# Altium schematic sheet 如意硬件GPRS模块0831.SchDoc
size A4
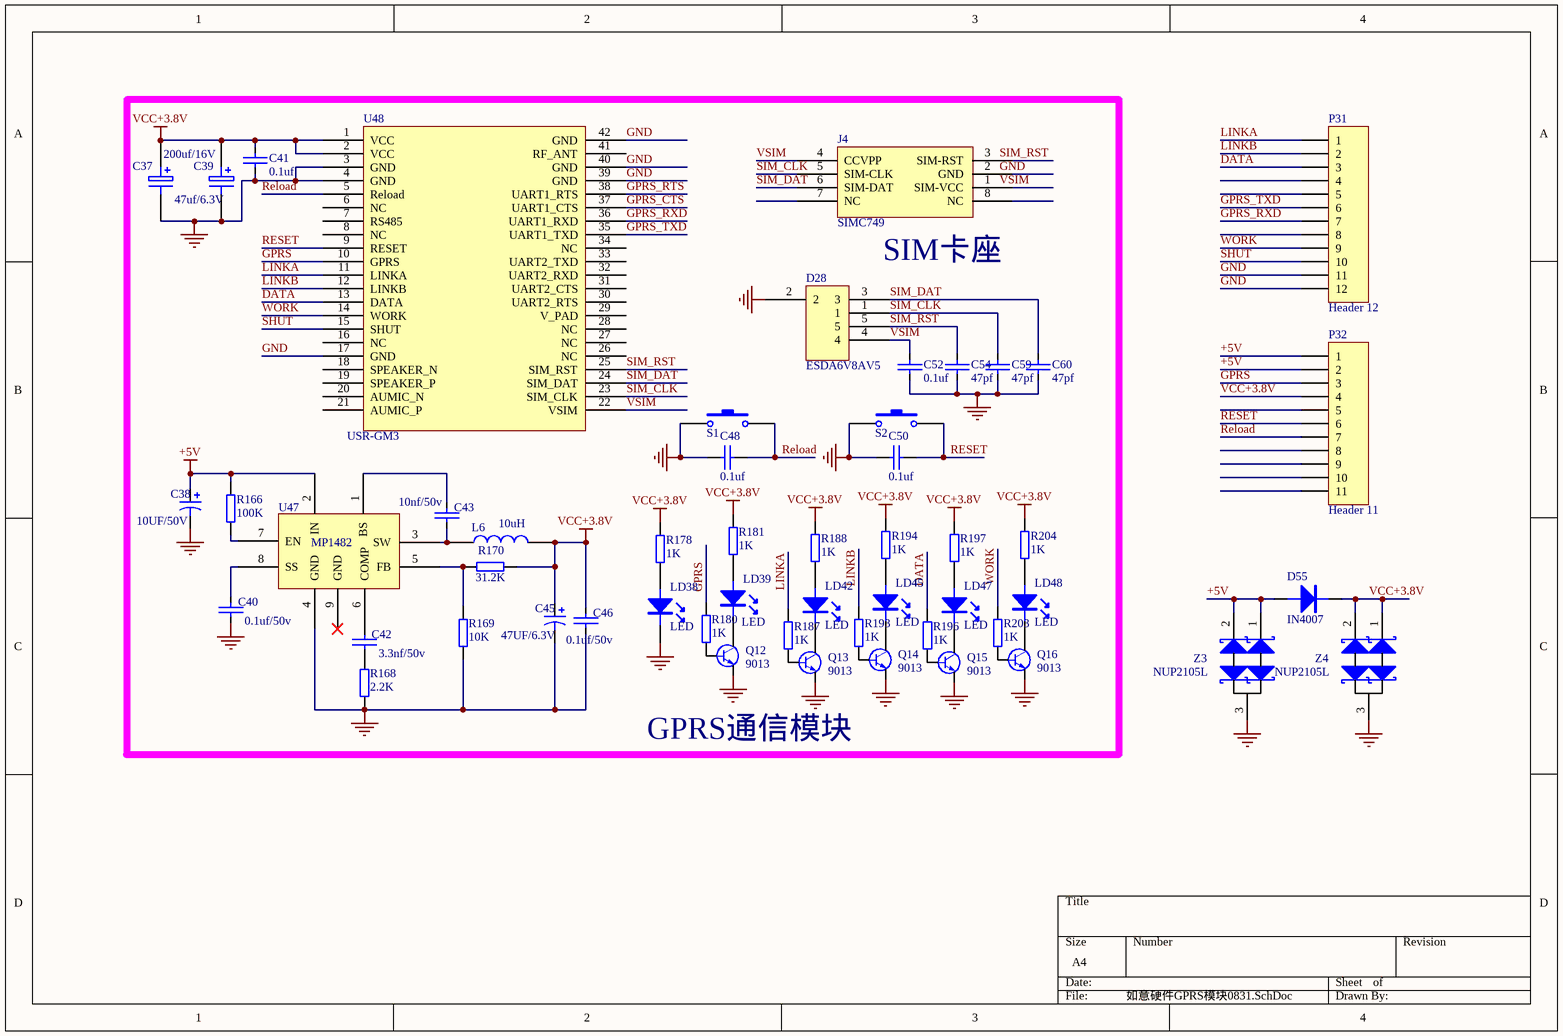
[diagram p0: 如意硬件GPRS模块0831.SchDoc]

## Parts
C37  200uf/16V  [1206D-S]
C38  value 10UF/50V  [1206D-S]  (hidden comment: Cap Pol1)
C39  47uf/6.3V  [1206D-S]
C40  0.1uf/50v  [0603C-1]
C41  0.1uf  [0603C-1]
C42  3.3nf/50v  [0603C-1]
C43  10nf/50v  [1206D-S]
C45  value 47UF/6.3V  [1206D-S]  (hidden comment: Cap Pol1)
C46  0.1uf/50v  [0603C-1]
C48  0.1uf  [0603C-1]
C50  0.1uf  [0603C-1]
C52  0.1uf  [0603C-1]
C54  47pf  [0603C-1]
C59  47pf  [0603C-1]
C60  47pf  [0603C-1]
D28  ESDA6V8AV5  [SOT-553]
D55  IN4007  [DIODETP-5]
J4  SIMC749  [SIMPUSH]
L6  10uH  [NR8030]
LD38  LED  [LED_Z1]
LD39  LED  [LED_Z1]
LD42  LED  [LED_Z1]
LD45  LED  [LED_Z1]
LD47  LED  [LED_Z1]
LD48  LED  [LED_Z1]
P31  Header 12  [HDR1X12]
P32  Header 11  [HDR1X11]
Q12  9013  [SOT23-BCE]
Q13  9013  [SOT23-BCE]
Q14  9013  [SOT23-BCE]
Q15  9013  [SOT23-BCE]
Q16  9013  [SOT23-BCE]
R166  100K  [0603R-1]
R168  2.2K  [0603R-1]
R169  10K  [0603R-1]
R170  31.2K  [0603R-1]
R178  1K  [0603R-1]
R180  1K  [0603R-1]
R181  1K  [0603R-1]
R187  1K  [0603R-1]
R188  1K  [0603R-1]
R193  1K  [0603R-1]
R194  1K  [0603R-1]
R196  1K  [0603R-1]
R197  1K  [0603R-1]
R203  1K  [0603R-1]
R204  1K  [0603R-1]
S1  SW-PB  [SW_PB4_A1]  (value not drawn)
S2  SW-PB  [SW_PB4_A1]  (value not drawn)
U47  MP1482  [SO-8]  (value not drawn)
U48  USR-GM3  [USR-GM3]
Z3  NUP2105L  [SOT-23]
Z4  NUP2105L  [SOT-23]

## Nets
+5V: C38.1 D55.1(A) P32.1 P32.2 R166.1 U47.2(IN) Z3.1 Z3.2
GND: C37.2 C38.2 C39.2 C40.2 C41.2 C45.2 C46.2 C48.2 C50.2 C52.2 C54.2 C59.2 C60.2 D28.2 LD38.2 P31.11 P31.12 Q12.E Q13.E Q14.E Q15.E Q16.E R168.2 R169.2 S1.1 S2.1 U47.4(GND) U48.3(GND) U48.4(GND) U48.17(GND) U48.39(GND) U48.40(GND) U48.42(GND) Z3.3 Z4.3
VCC+3.8V: C37.1 C39.1 C41.1 C45.1 C46.1 D55.2(K) L6.2 P32.4 R170.2 R178.1 R181.1 R188.1 R194.1 R197.1 R204.1 U48.1(VCC) U48.2(VCC) Z4.1 Z4.2
DATA: P31.3 R196.1 U48.13(DATA)
GPRS: P32.3 R180.1 U48.10(GPRS)
GPRS_CTS: U48.37(UART1_CTS)
GPRS_RTS: U48.38(UART1_RTS)
GPRS_RXD: P31.7 U48.36(UART1_RXD)
GPRS_TXD: P31.6 U48.35(UART1_TXD)
LINKA: P31.1 R187.1 U48.11(LINKA)
LINKB: P31.2 R193.1 U48.12(LINKB)
Reload: C48.1 P32.7 S1.2 U48.5(Reload)
RESET: C50.1 P32.6 S2.2 U48.9(RESET)
SHUT: P31.10 U48.15(SHUT)
SIM_CLK: C59.1 D28.1 J4.5(SIM-CLK) U48.23(SIM_CLK)
SIM_DAT: C60.1 D28.3 J4.6(SIM-DAT) U48.24(SIM_DAT)
SIM_RST: C54.1 D28.5 U48.25(SIM_RST)
VSIM: C52.1 D28.4 J4.4(CCVPP) U48.22(VSIM)
WORK: P31.9 R203.1 U48.14(WORK)
NetC40_1: C40.1 U47.8(SS)
NetC42_1: C42.1 U47.6(COMP)
NetC42_2: C42.2 R168.1
NetC43_1: C43.1 U47.1(BS)
NetC43_2: C43.2 L6.1 U47.3(SW)
NetLD38_1: LD38.1 R178.2
NetLD39_1: LD39.1 R181.2
NetLD39_2: LD39.2 Q12.C
NetLD42_1: LD42.1 R188.2
NetLD42_2: LD42.2 Q13.C
NetLD45_1: LD45.1 R194.2
NetLD45_2: LD45.2 Q14.C
NetLD47_1: LD47.1 R197.2
NetLD47_2: LD47.2 Q15.C
NetLD48_1: LD48.1 R204.2
NetLD48_2: LD48.2 Q16.C
NetQ12_B: Q12.B R180.2
NetQ13_B: Q13.B R187.2
NetQ14_B: Q14.B R193.2
NetQ15_B: Q15.B R196.2
NetQ16_B: Q16.B R203.2
NetR166_2: R166.2 U47.7(EN)
NetR169_1: R169.1 R170.1 U47.5(FB)

Not connected (* = marked no-connect by the designer): J4 1(SIM-VCC) 2(GND) 3(SIM-RST) 7(NC) 8(NC); P31 4 5 8; P32 5 8 9 10 11; U47 9(GND)*; U48 6(NC) 7(RS485) 8(NC) 16(NC) 18(SPEAKER_N) 19(SPEAKER_P) 20(AUMIC_N) 21(AUMIC_P) 26(NC) 27(NC) 28(NC) 29(V_PAD) 30(UART2_RTS) 31(UART2_CTS) 32(UART2_RXD) 33(UART2_TXD) 34(NC) 41(RF_ANT)

## Notes on the sheet
- SIM卡座
- GPRS通信模块
- Labels drawn without touching a wire or pin: GND, SIM_RST, VSIM

## Library data of the parts
C37 C39 = ELECTRO1: Electrolytic Capacitor
C38 C45 = Cap Pol1: Polarized Capacitor (Radial); Published: 8-Jun-2000; LatestRevisionDate: 17-Jul-2002; LatestRevisionNote: Re-released for DXP Platform.; PackageReference: RB7.6-15; Publisher: Altium Limited
C40-C43 C46 C52 C54 C59 C60 = C
C48 C50 = CAP: Capacitor
D55 = DIODE
L6 = INDUCTOR
P31 = Header 12: Header, 12-Pin; LatestRevisionDate: 17-Jul-2002; LatestRevisionNote: Re-released for DXP Platform.; Publisher: Altium Limited
P32 = Header 11: Header, 11-Pin; LatestRevisionDate: 17-Jul-2002; LatestRevisionNote: Re-released for DXP Platform.; Publisher: Altium Limited
Q12-Q16 = NPN
R166 R168-R170 R178 R180 R181 R187 R188 R193 R194 R196 R197 R203 R204 = RES-2
S1 S2 = SW-PB: Switch; Published: 24-Mar-1999; LatestRevisionDate: 17-Jul-2002; LatestRevisionNote: Re-released for DXP Platform.; PackageReference: SPST-2; Publisher: Altium Limited
Z3 Z4 = PESD1CAN: 过压保护